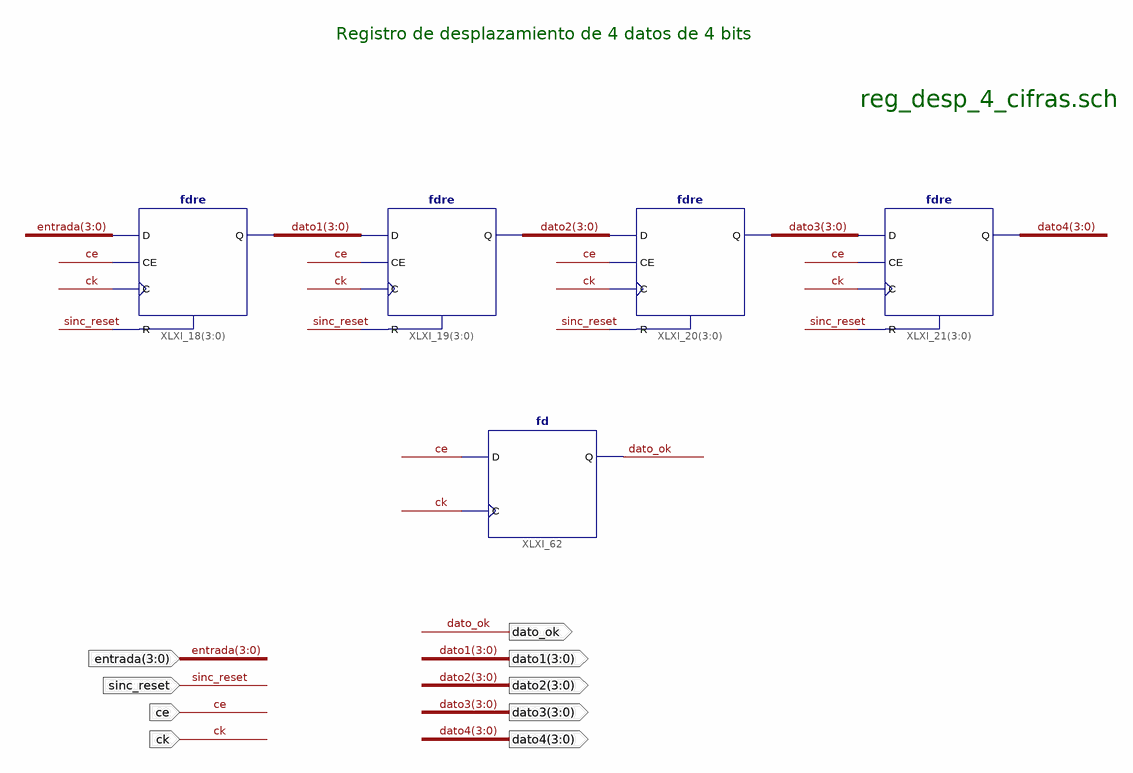
[diagram p0: schematic sheet 1]
// Xilinx ISE schematic reg_desp_4_cifras.sch (spartan6) as structural Verilog: 5 symbols, 9 ports
module reg_desp_4_cifras (
  input  [3:0] entrada,
  input  ck,
  input  ce,
  input  sinc_reset,
  output [3:0] dato1,
  output [3:0] dato2,
  output [3:0] dato3,
  output [3:0] dato4,
  output dato_ok
);

  fdre XLXI_18[3:0] (.C(ck), .CE(ce), .D(entrada), .R(sinc_reset), .Q(dato1));
  fdre XLXI_19[3:0] (.C(ck), .CE(ce), .D(dato1), .R(sinc_reset), .Q(dato2));
  fdre XLXI_20[3:0] (.C(ck), .CE(ce), .D(dato2), .R(sinc_reset), .Q(dato3));
  fdre XLXI_21[3:0] (.C(ck), .CE(ce), .D(dato3), .R(sinc_reset), .Q(dato4));
  fd XLXI_62 (.C(ck), .D(ce), .Q(dato_ok));

  // Notes on the sheet:
  //   Registro de desplazamiento de 4 datos de 4 bits
  //   reg_desp_4_cifras.sch
endmodule
